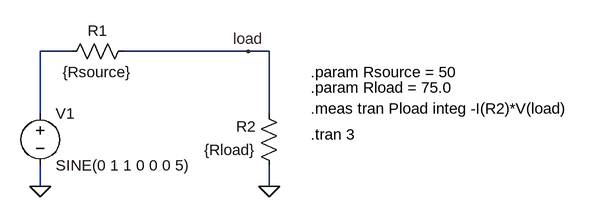
[diagram p0: schematic example2.asc]
example2.asc, the LTspice schematic file:
Version 4
SHEET 1 952 680
WIRE 112 48 64 48
WIRE 384 48 192 48
WIRE 416 48 384 48
WIRE 64 144 64 48
WIRE 416 144 416 48
WIRE 64 256 64 224
WIRE 416 256 416 224
FLAG 416 256 0
FLAG 64 256 0
FLAG 384 48 load
SYMBOL voltage 64 128 R0
WINDOW 123 0 0 Left 2
WINDOW 39 0 0 Left 2
SYMATTR InstName V1
SYMATTR Value SINE(0 1 1 0 0 0 5)
SYMBOL res 208 32 R90
WINDOW 0 0 56 VBottom 2
WINDOW 3 32 56 VTop 2
SYMATTR InstName R1
SYMATTR Value {Rsource}
SYMBOL res 432 240 R180
WINDOW 0 36 76 Left 2
WINDOW 3 36 40 Left 2
SYMATTR InstName R2
SYMATTR Value {Rload}
TEXT 480 80 Left 2 !.param Rsource = 50
TEXT 480 104 Left 2 !.param Rload = 75.0
TEXT 480 136 Left 2 !.meas tran Pload integ -I(R2)*V(load)
TEXT 480 176 Left 2 !.tran 3

The netlist it stands for:
* example2.asc
V1 N001 0 SINE(0 1 1 0 0 0 5)
R1 load N001 {Rsource}
R2 0 load {Rload}
.param Rsource = 50
.param Rload = 75.0
.meas tran Pload integ -I(R2)*V(load)
.tran 3
.backanno
.end